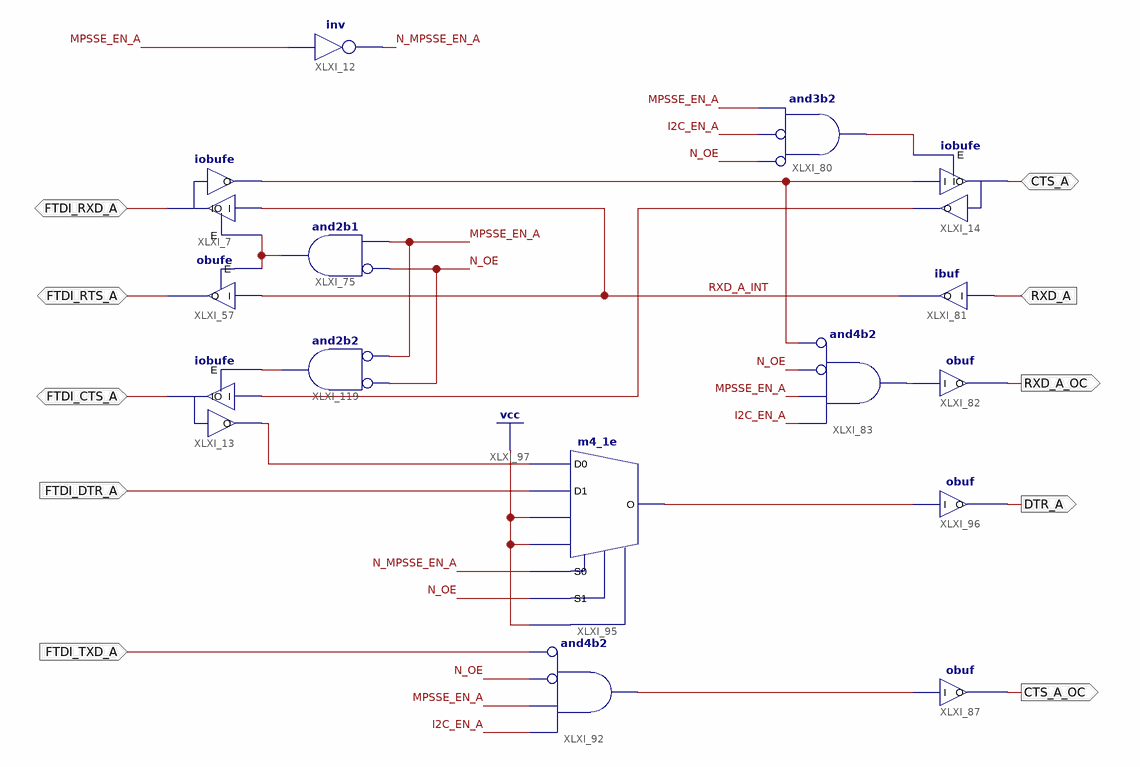
[diagram p0: schematic sheet 1]
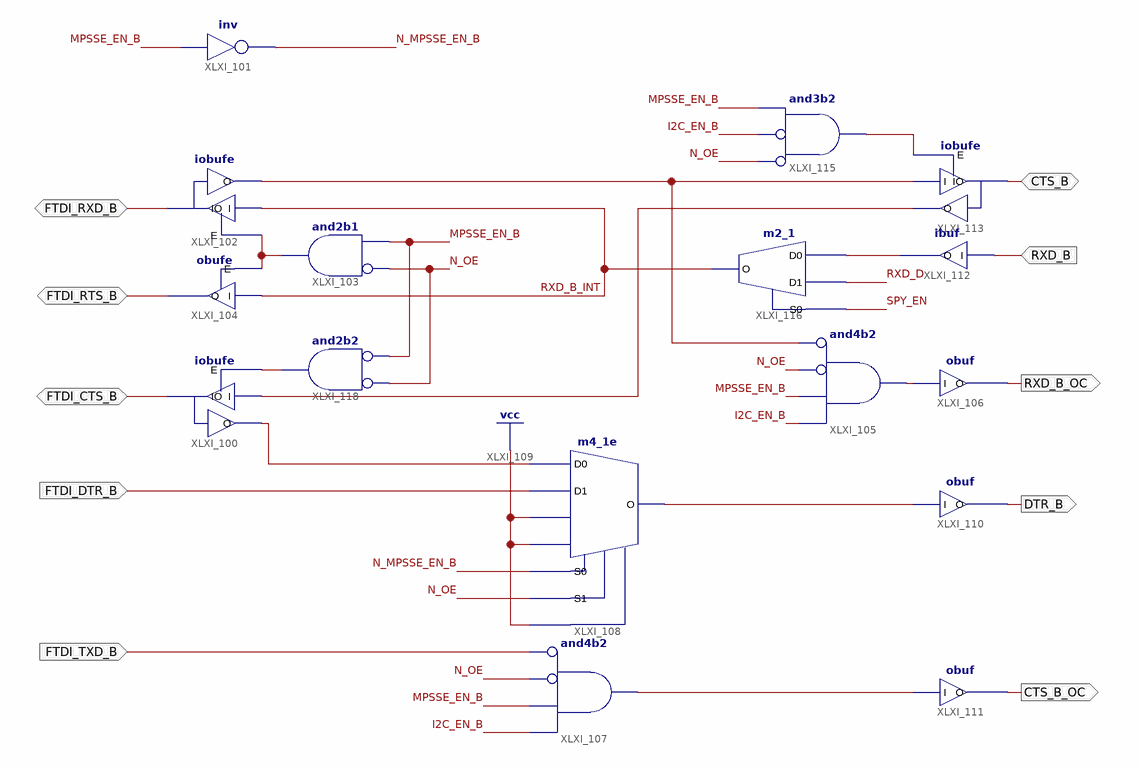
[diagram p1: schematic sheet 2]
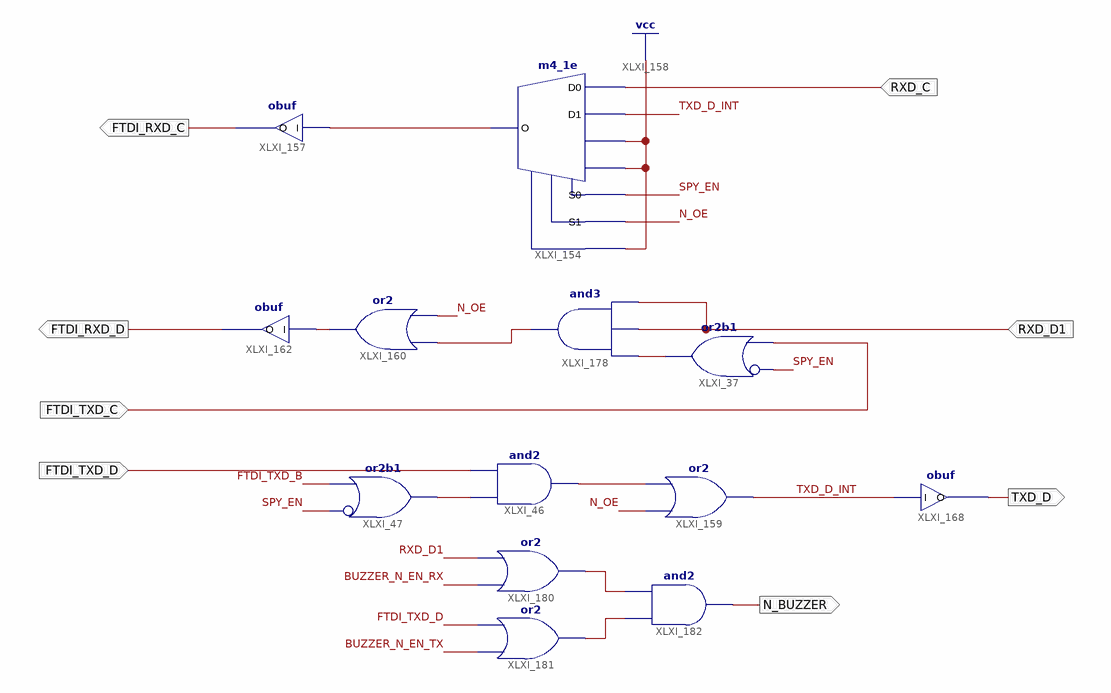
[diagram p2: schematic sheet 3]
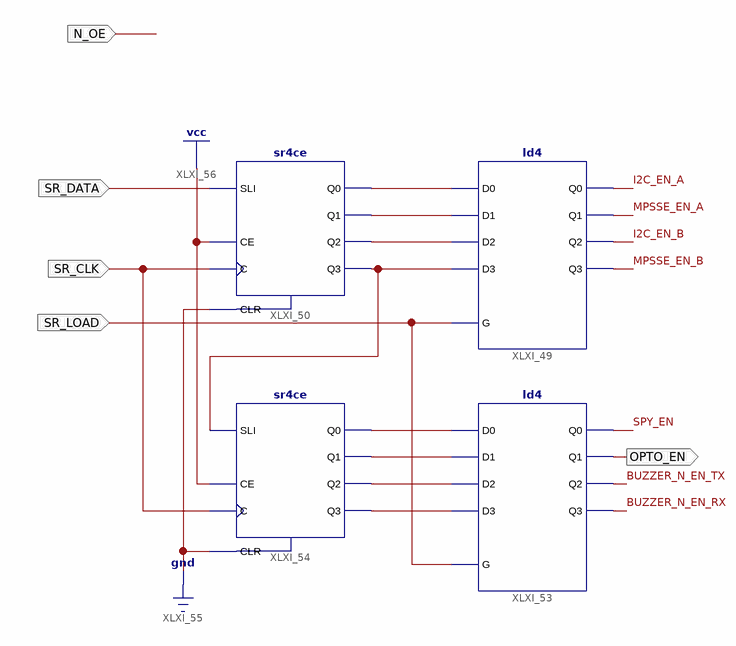
[diagram p3: schematic sheet 4]
// Xilinx ISE schematic SUPER_UART.sch (xc9500xl) as structural Verilog: 48 symbols, 34 ports
module SUPER_UART (
  input  FTDI_DTR_A,
  input  FTDI_TXD_B,
  input  FTDI_TXD_C,
  input  RXD_D,
  input  SR_DATA,
  input  N_OE,
  input  SR_CLK,
  input  RXD_A,
  input  FTDI_TXD_A,
  input  FTDI_DTR_B,
  input  RXD_B,
  input  RXD_C,
  input  FTDI_TXD_D,
  input  SR_LOAD,
  input  RXD_D1,
  inout  FTDI_RTS_A,
  inout  FTDI_CTS_A,
  inout  FTDI_RXD_A,
  inout  CTS_A,
  inout  FTDI_CTS_B,
  inout  FTDI_RXD_B,
  inout  CTS_B,
  inout  FTDI_RTS_B,
  output RXD_A_OC,
  output CTS_A_OC,
  output DTR_A,
  output RXD_B_OC,
  output CTS_B_OC,
  output DTR_B,
  output FTDI_RXD_C,
  output FTDI_RXD_D,
  output TXD_D,
  output OPTO_EN,
  output N_BUZZER
);

  wire BUZZER_N_EN_RX, BUZZER_N_EN_TX, I2C_EN_A, I2C_EN_B, MPSSE_EN_A, MPSSE_EN_B, N_MPSSE_EN_A,
       N_MPSSE_EN_B, RXD_A_INT, RXD_B_INT, SPY_EN, TXD_D_INT, XLXN_35, XLXN_46, XLXN_47, XLXN_103, XLXN_124,
       XLXN_137, XLXN_147, XLXN_149, XLXN_150, XLXN_159, XLXN_160, XLXN_161, XLXN_162, XLXN_168, XLXN_230,
       XLXN_239, XLXN_255, XLXN_271, XLXN_276, XLXN_284, XLXN_286, XLXN_287, XLXN_288, XLXN_296, XLXN_298,
       XLXN_303, XLXN_309, XLXN_312, XLXN_317, XLXN_410, XLXN_415, XLXN_430, XLXN_460, XLXN_466, XLXN_467;

  iobufe XLXI_13 (.I(XLXN_46), .IO(FTDI_CTS_A), .O(XLXN_47), .E(XLXN_276));
  ld4 XLXI_49 (
    .D0(XLXN_147), .D1(XLXN_149), .D2(XLXN_150), .D3(XLXN_168), .G(SR_LOAD), .Q0(I2C_EN_A), .Q1(MPSSE_EN_A),
    .Q2(I2C_EN_B), .Q3(MPSSE_EN_B));
  sr4ce XLXI_50 (
    .C(SR_CLK), .CE(1'b1), .CLR(1'b0), .SLI(SR_DATA), .Q0(XLXN_147), .Q1(XLXN_149), .Q2(XLXN_150),
    .Q3(XLXN_168));
  ld4 XLXI_53 (
    .D0(XLXN_159), .D1(XLXN_160), .D2(XLXN_161), .D3(XLXN_162), .G(SR_LOAD), .Q0(SPY_EN), .Q1(OPTO_EN),
    .Q2(BUZZER_N_EN_TX), .Q3(BUZZER_N_EN_RX));
  sr4ce XLXI_54 (
    .C(SR_CLK), .CE(1'b1), .CLR(1'b0), .SLI(XLXN_168), .Q0(XLXN_159), .Q1(XLXN_160), .Q2(XLXN_161),
    .Q3(XLXN_162));
  obufe XLXI_57 (.E(XLXN_230), .I(RXD_A_INT), .O(FTDI_RTS_A));
  not XLXI_12 (N_MPSSE_EN_A, MPSSE_EN_A);
  iobufe XLXI_7 (.I(RXD_A_INT), .IO(FTDI_RXD_A), .O(XLXN_124), .E(XLXN_230));
  and XLXI_75 (XLXN_230, ~N_OE, MPSSE_EN_A);  // and2b1
  iobufe XLXI_14 (.I(XLXN_124), .IO(CTS_A), .O(XLXN_46), .E(XLXN_35));
  and XLXI_80 (XLXN_35, ~N_OE, ~I2C_EN_A, MPSSE_EN_A);  // and3b2
  ibuf XLXI_81 (.I(RXD_A), .O(RXD_A_INT));
  and XLXI_83 (XLXN_239, ~XLXN_124, ~N_OE, MPSSE_EN_A, I2C_EN_A);  // and4b2
  obuf XLXI_82 (.I(XLXN_239), .O(RXD_A_OC));
  obuf XLXI_87 (.I(XLXN_255), .O(CTS_A_OC));
  and XLXI_92 (XLXN_255, ~FTDI_TXD_A, ~N_OE, MPSSE_EN_A, I2C_EN_A);  // and4b2
  m4_1e XLXI_95 (
    .D0(XLXN_47), .D1(FTDI_DTR_A), .D2(1'b1), .D3(1'b1), .E(1'b1), .S0(N_MPSSE_EN_A), .S1(N_OE), .O(XLXN_271));
  obuf XLXI_96 (.I(XLXN_271), .O(DTR_A));
  and XLXI_119 (XLXN_276, ~N_OE, ~MPSSE_EN_A);  // and2b2
  iobufe XLXI_100 (.I(XLXN_286), .IO(FTDI_CTS_B), .O(XLXN_298), .E(XLXN_312));
  iobufe XLXI_102 (.I(RXD_B_INT), .IO(FTDI_RXD_B), .O(XLXN_287), .E(XLXN_288));
  and XLXI_103 (XLXN_288, ~N_OE, MPSSE_EN_B);  // and2b1
  obufe XLXI_104 (.E(XLXN_288), .I(RXD_B_INT), .O(FTDI_RTS_B));
  and XLXI_105 (XLXN_296, ~XLXN_287, ~N_OE, MPSSE_EN_B, I2C_EN_B);  // and4b2
  obuf XLXI_106 (.I(XLXN_296), .O(RXD_B_OC));
  and XLXI_107 (XLXN_303, ~FTDI_TXD_B, ~N_OE, MPSSE_EN_B, I2C_EN_B);  // and4b2
  m4_1e XLXI_108 (
    .D0(XLXN_298), .D1(FTDI_DTR_B), .D2(1'b1), .D3(1'b1), .E(1'b1), .S0(N_MPSSE_EN_B), .S1(N_OE), .O(XLXN_309));
  obuf XLXI_110 (.I(XLXN_309), .O(DTR_B));
  obuf XLXI_111 (.I(XLXN_303), .O(CTS_B_OC));
  iobufe XLXI_113 (.I(XLXN_287), .IO(CTS_B), .O(XLXN_286), .E(XLXN_284));
  and XLXI_115 (XLXN_284, ~N_OE, ~I2C_EN_B, MPSSE_EN_B);  // and3b2
  not XLXI_101 (N_MPSSE_EN_B, MPSSE_EN_B);
  m2_1 XLXI_116 (.D0(XLXN_317), .D1(RXD_D), .S0(SPY_EN), .O(RXD_B_INT));
  ibuf XLXI_112 (.I(RXD_B), .O(XLXN_317));
  and XLXI_118 (XLXN_312, ~N_OE, ~MPSSE_EN_B);  // and2b2
  m4_1e XLXI_154 (.D0(RXD_C), .D1(TXD_D_INT), .D2(1'b1), .D3(1'b1), .E(1'b1), .S0(SPY_EN), .S1(N_OE), .O(XLXN_410));
  obuf XLXI_157 (.I(XLXN_410), .O(FTDI_RXD_C));
  obuf XLXI_162 (.I(XLXN_415), .O(FTDI_RXD_D));
  or XLXI_160 (XLXN_415, XLXN_460, N_OE);
  or XLXI_37 (XLXN_103, ~SPY_EN, FTDI_TXD_C);  // or2b1
  and XLXI_46 (XLXN_430, XLXN_137, FTDI_TXD_D);
  or XLXI_159 (TXD_D_INT, N_OE, XLXN_430);
  or XLXI_47 (XLXN_137, ~SPY_EN, FTDI_TXD_B);  // or2b1
  obuf XLXI_168 (.I(TXD_D_INT), .O(TXD_D));
  and XLXI_178 (XLXN_460, XLXN_103, RXD_D1, RXD_D1);
  or XLXI_180 (XLXN_466, BUZZER_N_EN_RX, RXD_D1);
  or XLXI_181 (XLXN_467, BUZZER_N_EN_TX, FTDI_TXD_D);
  and XLXI_182 (N_BUZZER, XLXN_467, XLXN_466);
endmodule
